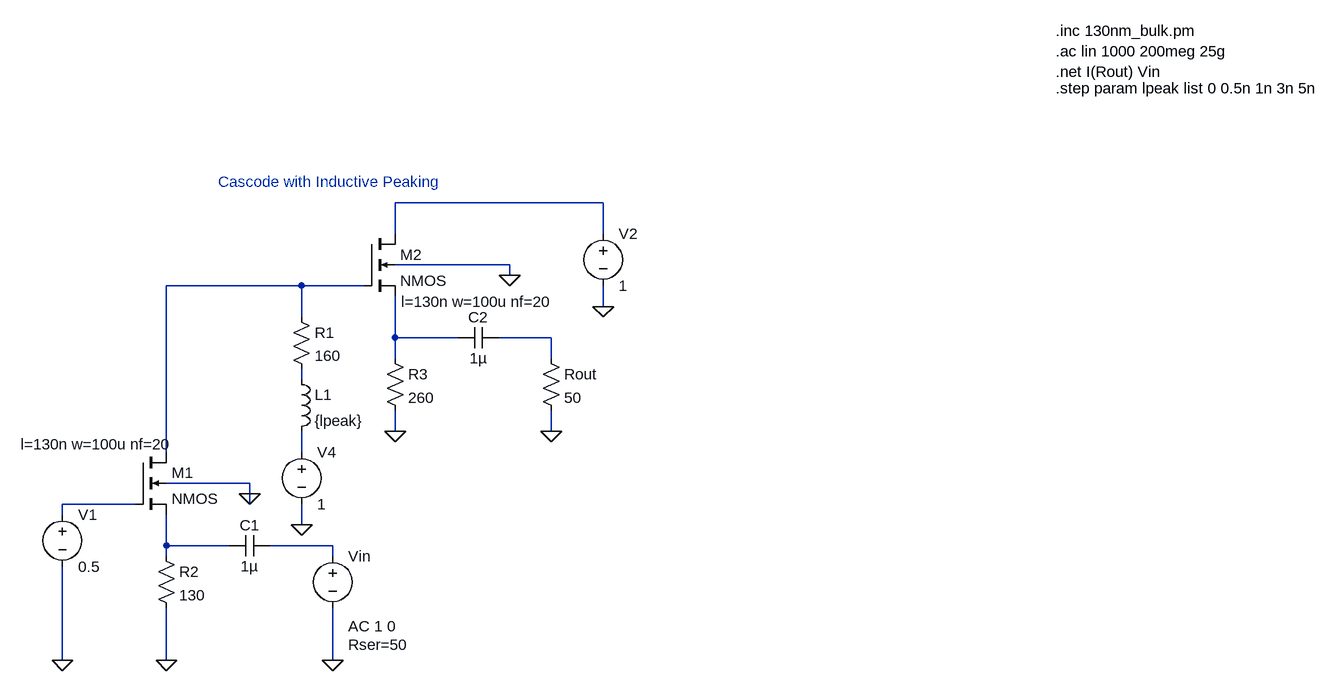
[diagram p0: schematic Cascode_Inductive_Peaking.asc]
Cascode_Inductive_Peaking.asc, the LTspice schematic file:
Version 4
SHEET 1 1980 680
WIRE 864 -288 544 -288
WIRE 544 -240 544 -288
WIRE 864 -240 864 -288
WIRE 720 -192 544 -192
WIRE 720 -176 720 -192
WIRE 400 -160 192 -160
WIRE 496 -160 400 -160
WIRE 864 -128 864 -160
WIRE 400 -112 400 -160
WIRE 544 -80 544 -144
WIRE 640 -80 544 -80
WIRE 784 -80 704 -80
WIRE 544 -48 544 -80
WIRE 784 -48 784 -80
WIRE 400 -16 400 -32
WIRE 544 64 544 32
WIRE 784 64 784 32
WIRE 192 96 192 -160
WIRE 400 96 400 64
WIRE 320 144 192 144
WIRE 320 160 320 144
WIRE 144 176 32 176
WIRE 320 176 320 160
WIRE 32 192 32 176
WIRE 400 208 400 176
WIRE 192 240 192 192
WIRE 288 240 192 240
WIRE 448 240 352 240
WIRE 192 256 192 240
WIRE 448 256 448 240
WIRE 32 416 32 272
WIRE 192 416 192 336
WIRE 448 416 448 336
FLAG 32 416 0
FLAG 192 416 0
FLAG 448 416 0
FLAG 400 208 0
FLAG 544 64 0
FLAG 784 64 0
FLAG 864 -128 0
FLAG 720 -176 0
FLAG 320 160 0
SYMBOL voltage 32 176 R0
SYMATTR InstName V1
SYMATTR Value 0.5
SYMBOL nmos4 144 96 R0
WINDOW 123 -176 -12 Left 2
SYMATTR Value2 l=130n w=100u nf=20
SYMATTR InstName M1
SYMBOL nmos4 496 -240 R0
WINDOW 123 57 105 Left 2
SYMATTR Value2 l=130n w=100u nf=20
SYMATTR InstName M2
SYMBOL voltage 864 -256 R0
SYMATTR InstName V2
SYMATTR Value 1
SYMBOL res 384 -128 R0
SYMATTR InstName R1
SYMATTR Value 160
SYMBOL ind 384 -32 R0
SYMATTR InstName L1
SYMATTR Value {lpeak}
SYMBOL res 176 240 R0
SYMATTR InstName R2
SYMATTR Value 130
SYMBOL cap 352 224 R90
WINDOW 0 0 32 VBottom 2
WINDOW 3 32 32 VTop 2
SYMATTR InstName C1
SYMATTR Value 1µ
SYMBOL voltage 448 240 R0
WINDOW 123 24 124 Left 2
WINDOW 39 24 152 Left 2
SYMATTR Value2 AC 1 0
SYMATTR SpiceLine Rser=50
SYMATTR InstName Vin
SYMATTR Value ""
SYMBOL voltage 400 80 R0
SYMATTR InstName V4
SYMATTR Value 1
SYMBOL res 528 -64 R0
SYMATTR InstName R3
SYMATTR Value 260
SYMBOL cap 704 -96 R90
WINDOW 0 0 32 VBottom 2
WINDOW 3 32 32 VTop 2
SYMATTR InstName C2
SYMATTR Value 1µ
SYMBOL res 768 -64 R0
SYMATTR InstName Rout
SYMATTR Value 50
TEXT 1560 -552 Left 2 !.inc 130nm_bulk.pm\n.ac lin 1000 200meg 25g\n.net I(Rout) Vin
TEXT 1560 -464 Left 2 !.step param lpeak list 0 0.5n 1n 3n 5n
TEXT 272 -320 Left 2 ;Cascode with Inductive Peaking

The netlist it stands for:
* Cascode_Inductive_Peaking.asc
V1 N007 0 0.5
M1 N002 N007 N008 0 NMOS l=130n w=100u nf=20
M2 N001 N002 N003 0 NMOS l=130n w=100u nf=20
V2 N001 0 1
R1 N002 N005 160
L1 N005 N006 {lpeak}
R2 N008 0 130
C1 N009 N008 1µ
Vin N009 0 AC 1 0 Rser=50
V4 N006 0 1
R3 N003 0 260
C2 N004 N003 1µ
Rout N004 0 50
.model NMOS NMOS
.model PMOS PMOS
.lib standard.mos
.inc 130nm_bulk.pm
.ac lin 1000 200meg 25g
.net I(Rout) Vin
.step param lpeak list 0 0.5n 1n 3n 5n
* Cascode with Inductive Peaking
.backanno
.end